# EAGLE design Pic32BB (EAGLE 8.7.1)
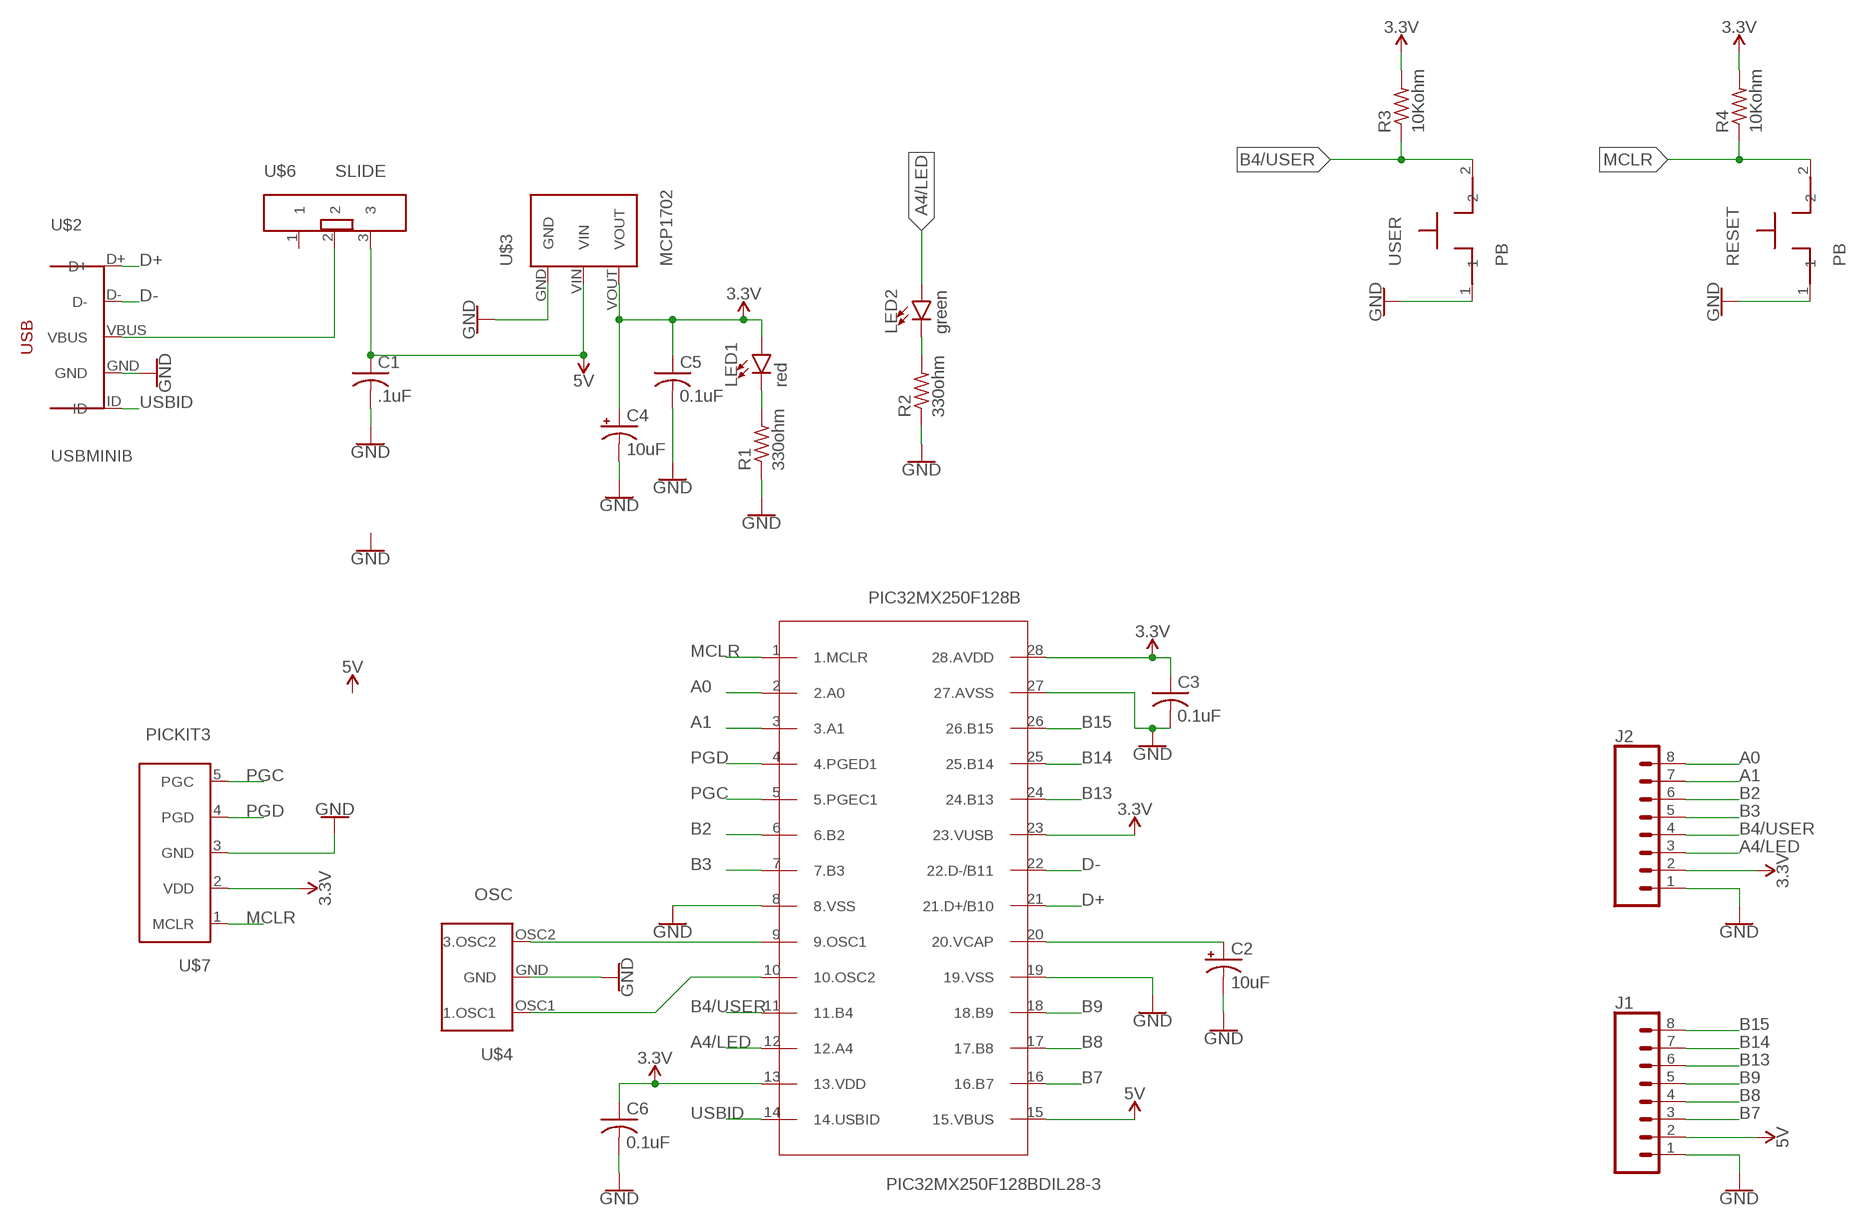
[diagram p0: schematic, sheet 1]

## Parts
C1  .1uF  C-US025-025X050  [C025-025X050]
C2  10uF  CPOL-USB45181B  [B45181B]
C3  0.1uF  C-US025-025X050  [C025-025X050]
C4  10uF  CPOL-USB45181B  [B45181B]
C5  0.1uF  C-US025-025X050  [C025-025X050]
C6  0.1uF  C-US025-025X050  [C025-025X050]
J1  CONN_08"  [1X08]
J2  CONN_08"  [1X08]
LED1  red  LED3MM  [LED_3MM]
LED2  green  LED3MM  [LED_3MM]
PIC32MX250F128B  PIC32MX250F128BDIL28-3  [DIL28-3]
R1  330ohm  R-US_0207/10  [0207/10]
R2  330ohm  R-US_0207/10  [0207/10]
R3  10Kohm  R-US_0207/10  [0207/10]
R4  10Kohm  R-US_0207/10  [0207/10]
RESET  PB  [PB]
U$2  USBMINIB  [USB-MB-H]
U$3  MCP1702  [TO92]
U$4  OSC  [OSC]
U$6  SLIDE  [SLIDE]
U$7  PICKIT3  [PICKIT3]
USER  PB  [PB]

## Nets
3.3V: C3.1 C4.+ C5.1 C6.1 J2.2 LED1.A PIC32MX250F128B.13(13.VDD) PIC32MX250F128B.23(23.VUSB) PIC32MX250F128B.28(28.AVDD) R3.2 R4.2 U$3.VOUT U$7.2(VDD)
5V: C1.1 J1.2 PIC32MX250F128B.15(15.VBUS) U$3.VIN U$6.3
A0: J2.8 PIC32MX250F128B.2(2.A0)
A1: J2.7 PIC32MX250F128B.3(3.A1)
A4/LED: J2.3 LED2.A PIC32MX250F128B.12(12.A4)
B2: J2.6 PIC32MX250F128B.6(6.B2)
B3: J2.5 PIC32MX250F128B.7(7.B3)
B4/USER: J2.4 PIC32MX250F128B.11(11.B4) R3.1 USER.2
B7: J1.3 PIC32MX250F128B.16(16.B7)
B8: J1.4 PIC32MX250F128B.17(17.B8)
B9: J1.5 PIC32MX250F128B.18(18.B9)
B13: J1.6 PIC32MX250F128B.24(24.B13)
B14: J1.7 PIC32MX250F128B.25(25.B14)
B15: J1.8 PIC32MX250F128B.26(26.B15)
D+: PIC32MX250F128B.21(21.D+/B10) U$2.D+
D-: PIC32MX250F128B.22(22.D-/B11) U$2.D-
GND: C1.2 C2.- C3.2 C4.- C5.2 C6.2 J1.1 J2.1 PIC32MX250F128B.8(8.VSS) PIC32MX250F128B.19(19.VSS) PIC32MX250F128B.27(27.AVSS) R1.1 R2.1 RESET.1 U$2.GND U$3.GND U$4.GND U$7.3(GND) USER.1
MCLR: PIC32MX250F128B.1(1.MCLR) R4.1 RESET.2 U$7.1(MCLR)
N$1: PIC32MX250F128B.9(9.OSC1) U$4.OSC2(3.OSC2)
N$2: PIC32MX250F128B.10(10.OSC2) U$4.OSC1(1.OSC1)
N$3: C2.+ PIC32MX250F128B.20(20.VCAP)
N$4: U$2.VBUS U$6.2
N$5: LED1.K(C) R1.2
N$6: LED2.K(C) R2.2
PGC: PIC32MX250F128B.5(5.PGEC1) U$7.5(PGC)
PGD: PIC32MX250F128B.4(4.PGED1) U$7.4(PGD)
USBID: PIC32MX250F128B.14(14.USBID) U$2.ID
Unconnected: U$6.1

## Library data of the parts
C1 C3 C5 C6 = resistor:C-US: CAPACITOR, American symbol
C2 C4 = resistor:CPOL-US: POLARIZED CAPACITOR, American symbol
J1 J2 = SparkFun-Connectors:CONN_08: Multi connection point. Often used as Generic Header-pin footprint for 0.1 inch spaced/style header connections On any of the 0.1 inch spaced packages, you can populate with these: Break Away Headers - Straight <https://www.sparkfun.com/products/116> (PRT-00116) Break Away Male Headers - Right Angle <https://www.sparkfun.com/products/553> (PRT-00553) Female Headers <https://www.sparkfun.com/products/115> (PRT-00115) Break Away Headers - Machine Pin <https://www.sparkfun.com/products/117> (PRT-00117) Break Away Female Headers - Swiss Machine Pin <https://www.sparkfun.com/products/743> (PRT-00743) Arduino Stackable Header - 8 Pin <https://www.sparkfun.com/products/9279> (PRT-09279) For SCREWTERMINALS and SPRING TERMINALS visit here: Screw Terimnals on SparkFun.com <https://www.sparkfun.com/search/results?term=Screw+Terminals> (5mm/3.5mm/2.54mm spacing) This device is also useful as a general connection point to wire up your design to another part of your project. Our various solder wires solder well into these plated through hole pads. Hook-Up Wire - Assortment (Stranded, 22 AWG) <https://www.sparkfun.com/products/11375> (PRT-11375) Hook-Up Wire - Assortment (Solid Core, 22 AWG) <https://www.sparkfun.com/products/11367> (PRT-11367) View the entire wire category on our website here <https://www.sparkfun.com/categories/141> Special notes: Molex polarized connector foot print use with SKU : PRT-08231 with associated crimp pins and housings. 1MM SMD Version SKU: PRT-10208 NOTES ON THE VARIANTS LOCK and LOCK_LONGPADS... This footprint was designed to help hold the alignment of a through-hole component (i.e. 6-pin header) while soldering it into place. You may notice that each hole has been shifted either up or down by 0.005 of an inch from it's more standard position (which is a perfectly straight line). This slight alteration caused the pins (the squares in the middle) to touch the edges of the holes. Because they are alternating, it causes a "brace" to hold the component in place. 0.005 has proven to be the perfect amount of "off-center" position when using our standard breakaway headers. Although looks a little odd when you look at the bare footprint, once you have a header in there, the alteration is very hard to notice. Also,if you push a header all the way into place, it is covered up entirely on the bottom side.; PROD_ID: CONN-08438
LED1 LED2 = SparkFun-LED:LED: LED (Generic) Standard schematic elements and footprints for 5mm, 3mm, 1206, and 0603 sized LEDs. Generic LEDs with no color specified.; PROD_ID: DIO-08794
PIC32MX250F128B = PIC32MX250F128B:PIC32MX250F128B
R1-R4 = resistor:R-US_: RESISTOR, American symbol
RESET USER = pushbutton:PB
U$2 = USB mini B:USBMINIB
U$3 = MCP1702:MCP1702
U$4 = oscillator:OSC
U$6 = SLIDESWITCH:SLIDE
U$7 = PICKIT3:PICKIT3

## Board
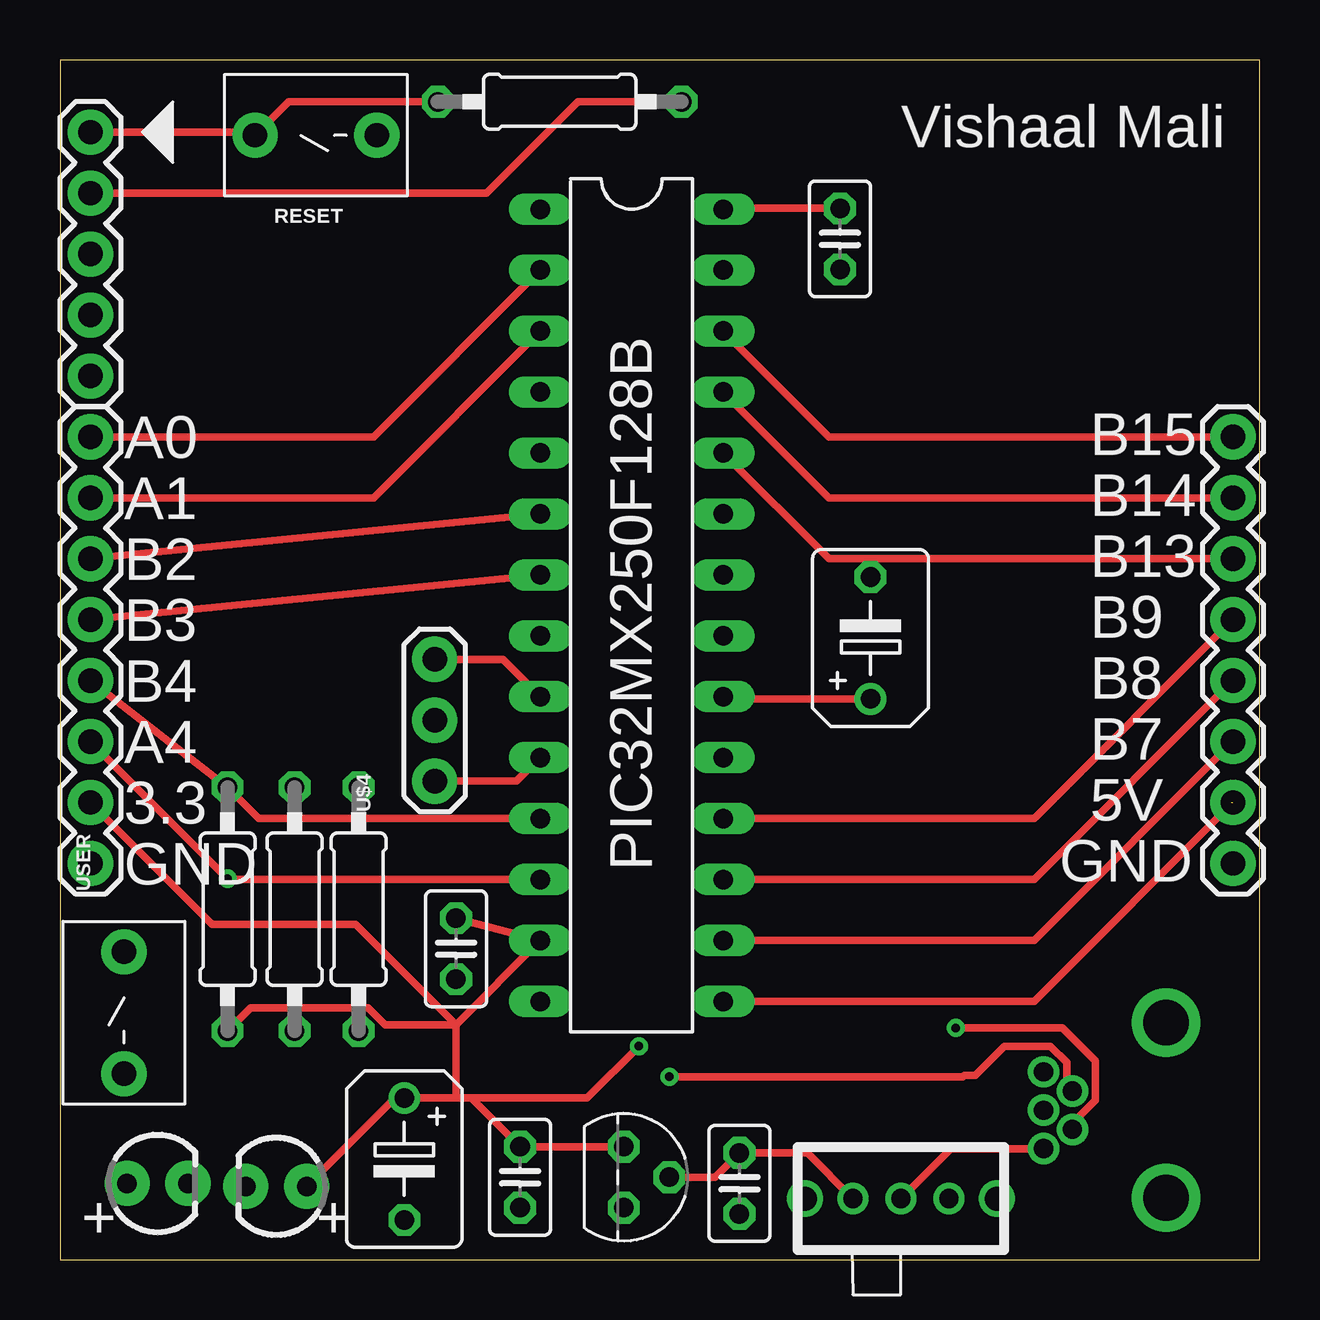
[diagram p1: board, top side]
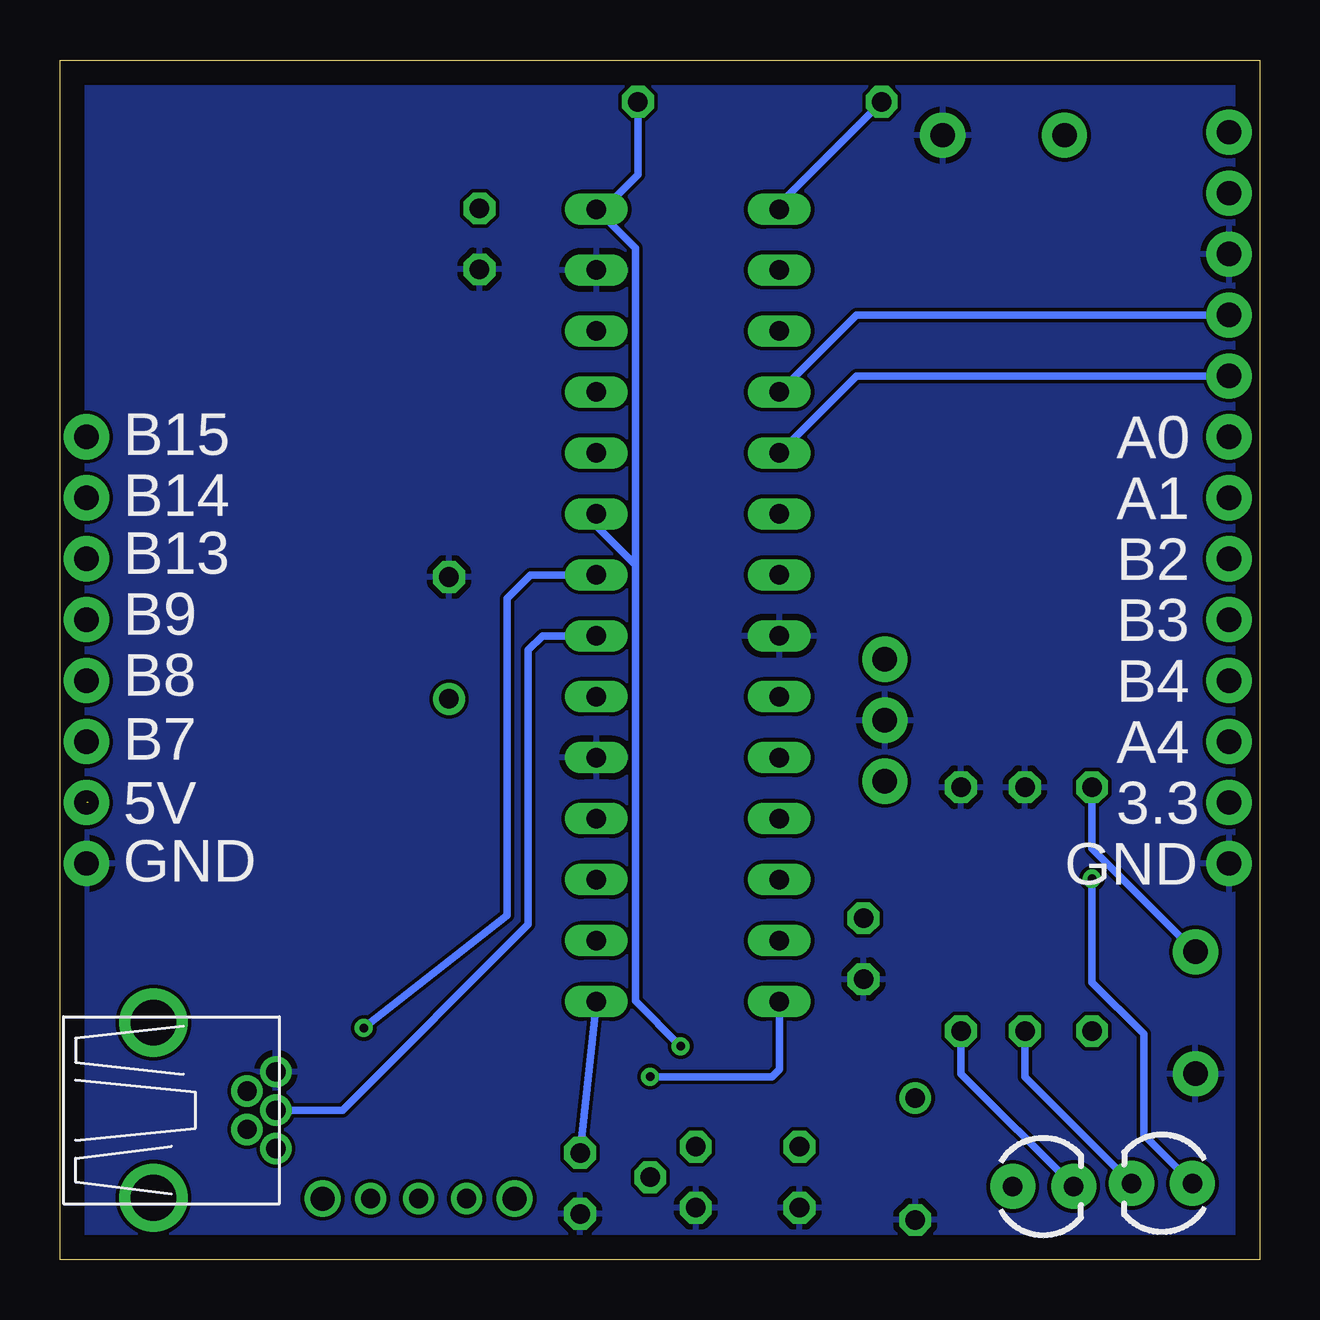
[diagram p2: board, bottom side, seen from below]

Size 50 x 50 mm. Coordinates in mm from the lower left corner, seen from the top.
Outline: 0,0 50,0 50,50 0,50 0,0
Copper layers (1*16): Top 0.035mm / dielectric 1.5mm / Bottom 0.035mm
Design rules "default": minimum track width 6mil, minimum drill 0.35mm, track to track 6mil, track to pad 6mil, pad to pad 6mil, via to via 6mil, smd to smd 6mil, copper to edge 40mil, drill to drill 6mil, minimum pad ring 10mil, minimum via ring 8mil, stop-mask expansion 4mil, vias tented up to drill 0mil, thermal gap 10mil

### Footprints (pad centres in the part's own frame; a part is rotated, then mirrored left to right if it is on the bottom)
C025-025X050 = drill 0.813 octagon: 1 -1.27,0; 2 1.27,0
B45181B = drill 0.813: + -2.54,0 | drill 0.813 octagon: - 2.54,0
1X08 = drill 1.016 pad 1.88: 1 0,0; 2 2.54,0; 3 5.08,0; 4 7.62,0; 5 10.16,0; 6 12.7,0; 7 15.24,0; 8 17.78,0
LED_3MM = drill 0.813 pad 1.88: A -1.27,0; K 1.27,0
DIL28-3 = drill 0.813 long: 1 -16.51,-3.81; 2 -13.97,-3.81; 3 -11.43,-3.81; 4 -8.89,-3.81; 5 -6.35,-3.81; 6 -3.81,-3.81; 7 -1.27,-3.81; 8 1.27,-3.81; 9 3.81,-3.81; 10 6.35,-3.81; 11 8.89,-3.81; 12 11.43,-3.81; 13 13.97,-3.81; 14 16.51,-3.81; 15 16.51,3.81; 16 13.97,3.81; 17 11.43,3.81; 18 8.89,3.81; 19 6.35,3.81; 20 3.81,3.81; 21 1.27,3.81; 22 -1.27,3.81; 23 -3.81,3.81; 24 -6.35,3.81; 25 -8.89,3.81; 26 -11.43,3.81; 27 -13.97,3.81; 28 -16.51,3.81
0207/10 = drill 0.813 octagon: 1 -5.08,0; 2 5.08,0
PB = drill 1.016 pad 1.88: 1 -2.54,0; 2 2.54,0
USB-MB-H = drill 0.8: D+ 5.1,0; D- 3.9,0.8; GND 5.1,-1.6; ID 3.9,-0.8; VBUS 5.1,1.6 | drill 1.9: P$6 0,-3.65; P$7 0,3.65
TO92 = drill 0.813 octagon: GND 1.27,0; VIN 0,1.905; VOUT -1.27,0
OSC = drill 1.016 pad 1.88: GND 0,0; OSC1 -2.54,0; OSC2 2.54,0
SLIDE = drill 0.8: 1 -2,0; 2 0,0; 3 2,0 | drill 1: P$1 -4,0; P$2 4,0
PICKIT3 = drill 1.016 pad 1.88: 1 -5.08,0; 2 -2.54,0; 3 0,0; 4 2.54,0; 5 5.08,0

### Placement (x,y rotation side)
C1  28.32,3.17 270 top
C2  33.78,25.91 90 top
C3  32.51,42.55 270 top
C4  14.35,4.19 270 top
C5  19.18,3.43 270 top
C6  16.51,12.95 270 top
J1  48.9,16.51 90 top
J2  1.27,16.51 90 top
LED1  9.02,3.05 180 top
LED2  4.06,3.17 0 top
PIC32MX250F128B  23.83,27.27 270 top
R1  12.45,14.61 270 top
R2  9.78,14.61 270 top
R3  6.99,14.61 270 top
R4  20.83,48.26 0 top
RESET  10.67,46.86 180 top
U$2  46.1,6.22 180 top
U$3  23.5,3.43 270 top
U$4  15.62,22.48 90 top
U$6  35.05,2.54 180 top
U$7  1.27,41.91 270 top
USER  2.67,10.29 90 top

### Tracks (layer width: path | path; a pad name or v marks a point on that pad's centre or on a via)
3.3V  (via drill 0.35)
  Top 0.305: U$3.VOUT C5.1 17.14,6.73 | 17.14,6.73 16.51,6.73 | 16.51,6.73 C4.+ 13.97,6.73 LED1.A | 16.51,6.73 16.51,9.79 | 16.51,9.79 PIC32MX250F128B.13 C6.1 | 17.14,6.73 21.97,6.73 v24.13,8.89 | C3.1 27.68,43.81 PIC32MX250F128B.28 | U$7.2 17.78,44.45 21.59,48.26 R4.2 | 16.51,9.79 12.33,13.97 6.35,13.97 J2.2 | 16.51,9.79 13.55,9.79 12.85,10.49 7.95,10.49 R3.2
  Bottom 0.305: v24.13,8.89 26.01,10.77 26.01,28.94 | PIC32MX250F128B.23 27.64,30.57 26.01,28.94 | 26.01,28.94 26.01,42.15 27.49,43.63 | 27.49,43.63 PIC32MX250F128B.28 | R4.2 25.91,45.21 27.49,43.63
5V  (1 unrouted)
  Top 0.305: U$6.3 31.15,4.45 C1.1 27.3,3.43 U$3.VIN | PIC32MX250F128B.15 40.6,10.76 48.83,18.99 48.83,19.05
  Bottom 0.305: C1.1 PIC32MX250F128B.15
A0
  Top 0.305: J2.8 13.07,34.29 PIC32MX250F128B.2
A1
  Top 0.305: J2.7 13.07,31.75 PIC32MX250F128B.3
A4/LED  (via drill 0.35)
  Top 0.305: J2.3 v6.99,15.88 7.02,15.84 PIC32MX250F128B.12
  Bottom 0.305: v6.99,15.88 6.99,11.56 4.83,9.4 4.83,5.21 LED2.A
B2
  Top 0.305: J2.6 PIC32MX250F128B.6
B3
  Top 0.305: J2.5 PIC32MX250F128B.7
B4/USER
  Top 0.305: J2.4 R3.1 8.29,18.38 PIC32MX250F128B.11
  Bottom 0.305: R3.1 6.99,17.14 USER.2
B7
  Top 0.305: J1.3 40.6,13.3 PIC32MX250F128B.16
B8
  Top 0.305: J1.4 40.6,15.84 PIC32MX250F128B.17
B9
  Top 0.305: J1.5 40.6,18.38 PIC32MX250F128B.18
B13
  Top 0.305: J1.6 32.05,29.21 PIC32MX250F128B.24
B14
  Top 0.305: J1.7 32.05,31.75 PIC32MX250F128B.25
B15
  Top 0.305: J1.8 32.05,34.29 PIC32MX250F128B.26
D+
  Bottom 0.305: U$2.D+ 38.23,6.22 30.48,13.97 30.48,25.4 29.88,26 PIC32MX250F128B.21
D-  (via drill 0.35)
  Top 0.305: U$2.D- 42.2,5.67 43.16,6.63 43.16,8.28 41.78,9.65 v37.34,9.65 37.21,9.65
  Bottom 0.305: PIC32MX250F128B.22 30.39,28.54 31.37,27.56 31.37,14.35 v37.34,9.65
GND
  pour Bottom: -1.27,50.8 52.07,50.8 50.8,-2.54 -2.54,-2.54 -2.54,50.8
MCLR
  Top 0.305: R4.1 9.53,48.26 8.57,47.31 8.26,46.99 | 8.26,46.99 RESET.2 | U$7.1 8.26,46.99
  Bottom 0.305: R4.1 20.02,43.99 PIC32MX250F128B.1
N$1
  Top 0.305: U$4.OSC2 18.46,25.02 PIC32MX250F128B.9
N$2
  Top 0.305: U$4.OSC1 19.04,19.94 PIC32MX250F128B.10
N$3
  Top 0.305: C2.+ 27.73,23.37 PIC32MX250F128B.20
N$4
  Top 0.305: U$2.VBUS 37.13,4.62 U$6.2
N$5
  Bottom 0.305: LED1.K 12.45,7.75 R1.2
N$6
  Bottom 0.305: LED2.K 9.78,7.62 R2.2
PGC
  Bottom 0.305: U$7.5 16.81,36.83 PIC32MX250F128B.5
PGD
  Bottom 0.305: U$7.4 16.81,39.37 PIC32MX250F128B.4
USBID  (via drill 0.35)
  Top 0.305: v25.4,7.62 37.64,7.62 37.69,7.67 38.15,7.67 39.37,8.89 41.29,8.89 41.96,8.22 41.96,7.26 U$2.ID
  Bottom 0.305: PIC32MX250F128B.14 20.02,7.92 20.32,7.62 v25.4,7.62

### Text on the board
tPlace: Vishaal Mali | B15 | A0 | A1 | B14 | B2 | B13 | B3 | B9 | B4 | B8 | A4 | B7 | 3.3 | 5V | GND | GND | + | +
bPlace: B15 | A0 | A1 | B14 | B13 | B2 | B3 | B9 | B4 | B8 | A4 | B7 | 3.3 | 5V | GND | GND